# EAGLE design breakout (EAGLE 8.6.0)
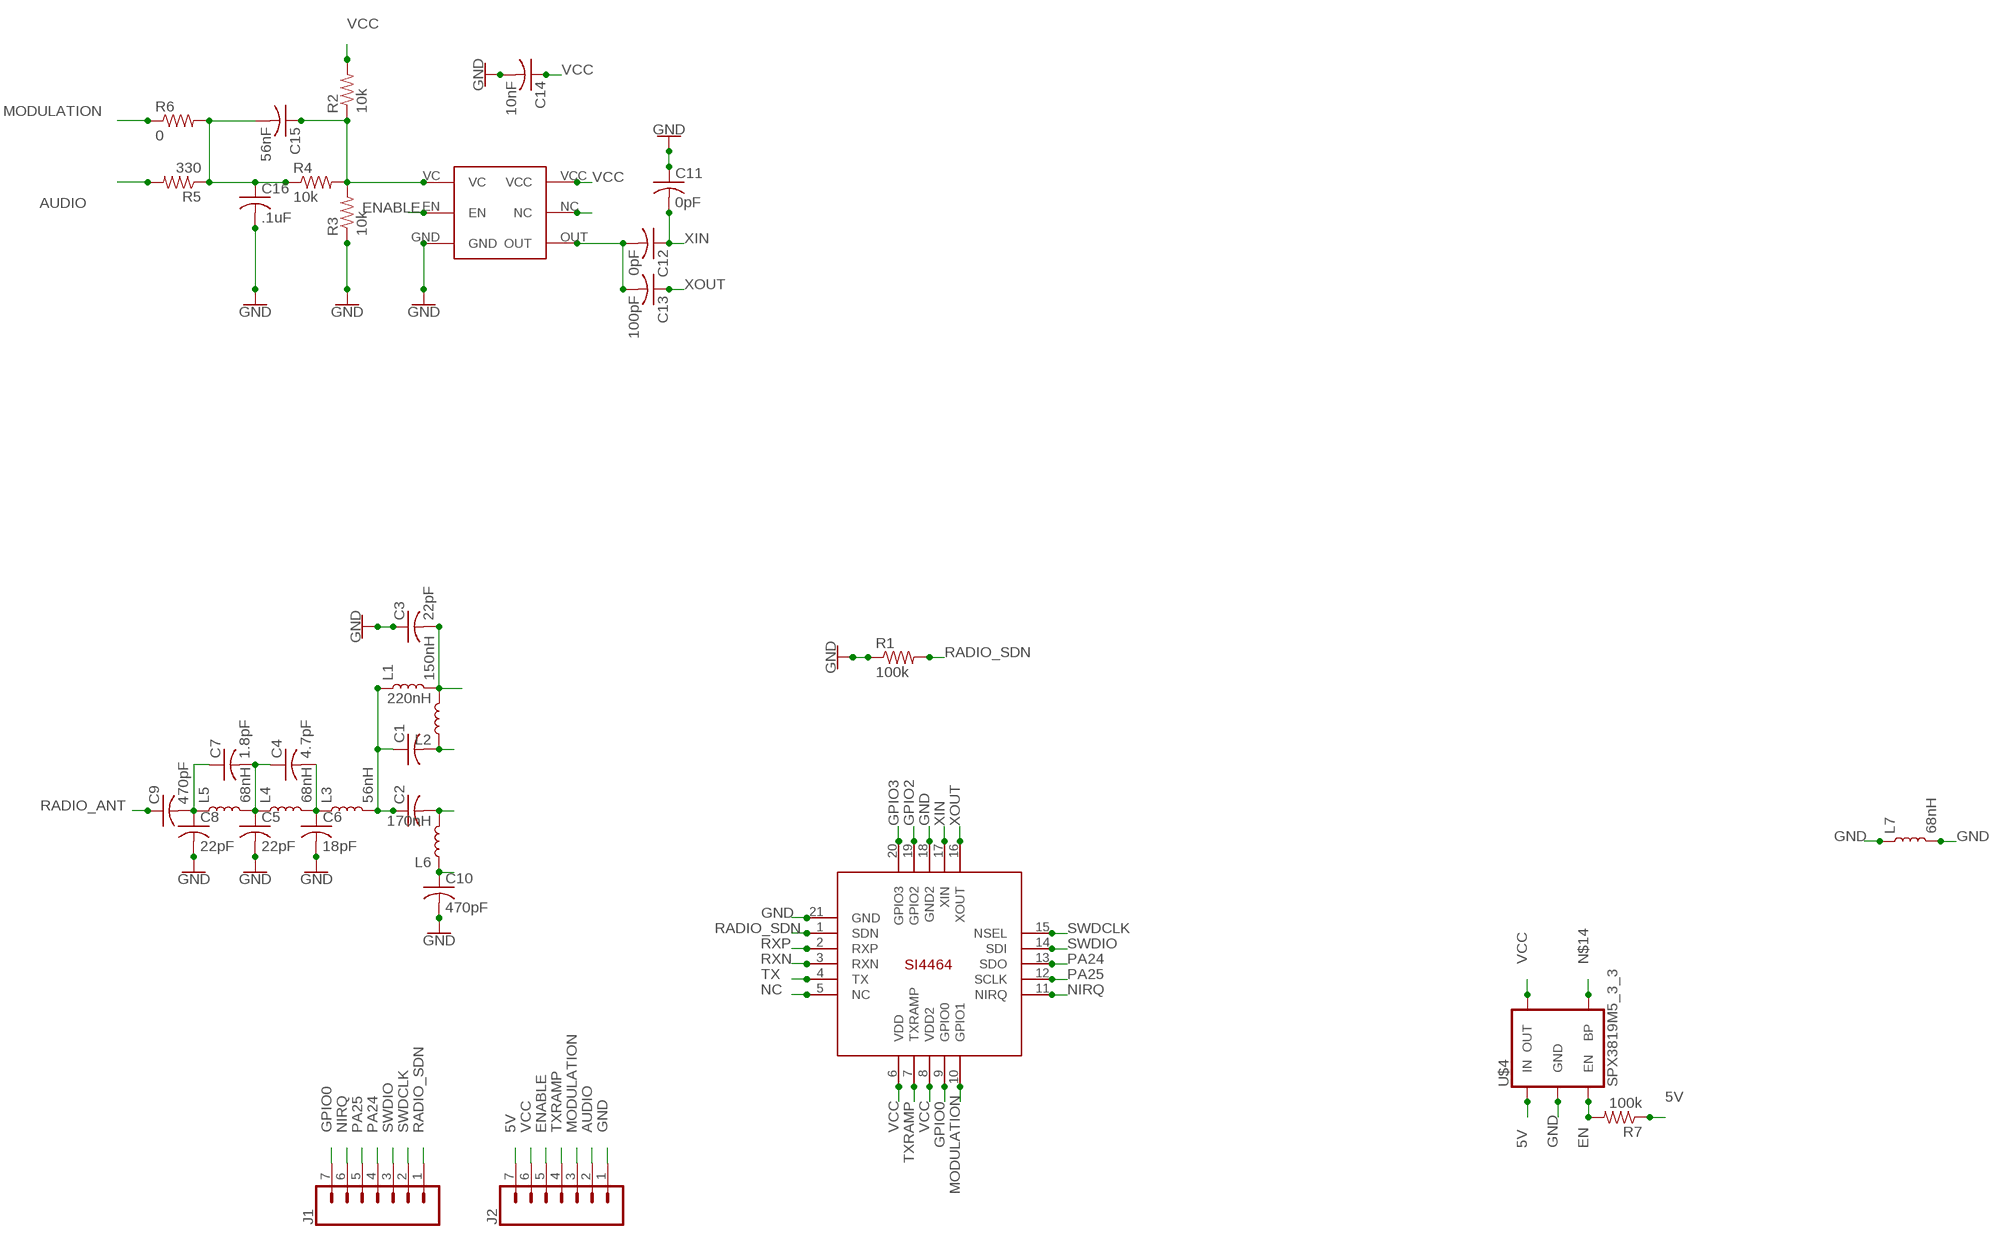
[diagram p0: schematic, sheet 1]

## Parts
C1  C-USC0402K  [C0402K]
C2  C-USC0402K  [C0402K]
C3  22pF  C-USC0402K  [C0402K]
C4  4.7pF  C-USC0402K  [C0402K]
C5  22pF  C-USC0402K  [C0402K]
C6  18pF  C-USC0402K  [C0402K]
C7  1.8pF  C-USC0402K  [C0402K]
C8  22pF  C-USC0402K  [C0402K]
C9  470pF  C-USC0402K  [C0402K]
C10  470pF  C-USC0402K  [C0402K]
C11  0pF  C-USC0402K  [C0402K]
C12  0pF  C-USC0402K  [C0402K]
C13  100pF  C-USC0402K  [C0402K]
C14  10nF  C-USC0402K  [C0402K]
C15  56nF  C-USC0402K  [C0402K]
C16  .1uF  C-USC0402K  [C0402K]
J1  CONN_07  [1X07]
J2  CONN_07  [1X07]
L1  150nH  INDUCTOR-0603-33NH  [0603]
L2  220nH  INDUCTOR-0603-33NH  [0603]
L3  56nH  INDUCTOR-0603-33NH  [0603]
L4  68nH  INDUCTOR-0603-33NH  [0603]
L5  68nH  INDUCTOR-0603-33NH  [0603]
L6  170nH  INDUCTOR-0603-33NH  [0603]
L7  68nH  INDUCTOR-0603-33NH  [0603]
R1  100k  R-US_R0402  [R0402]
R2  10k  R-US_R0402  [R0402]
R3  10k  R-US_R0402  [R0402]
R4  10k  R-US_R0402  [R0402]
R5  330  R-US_R0402  [R0402]
R6  0  R-US_R0402  [R0402]
R7  100k  R-US_R0402  [R0402]
U$1  HC53BR-27  [OSCILLATOR-SMD-7.5X5.2-6PIN]
U$2  SI4464  [QFN20+GNDPAD]
U$4  SPX3819M5_3_3  V_REG_SPX3819-SOT23-5  [SOT23-5]

## Nets
5V: J2.7 R7.1 U$4.1(IN)
AUDIO: J2.2 R5.2
EN: R7.2 U$4.3(EN)
ENABLE: J2.5 U$1.EN
GND: C3.1 C5.2 C6.2 C8.2 C10.2 C11.1 C14.2 C16.2 J2.1 L7.1 L7.2 R1.1 R3.1 U$1.GND U$2.18(GND2) U$2.21(GND) U$4.2(GND)
GPIO0: J1.7 U$2.9(GPIO0)
GPIO2: U$2.19(GPIO2)
GPIO3: U$2.20(GPIO3)
MODULATION: J2.3 R6.1 U$2.10(GPIO1)
N$1: C4.2 C6.1 L3.1 L4.2
N$2: C1.1 C2.1 L1.1 L3.2
N$3: C4.1 C5.1 C7.2 L4.1 L5.2
N$4: C15.2 C16.1 R4.1 R5.1 R6.2
N$5: C7.1 C8.1 C9.2 L5.1
N$6: C15.1 R2.1 R3.2 R4.2 U$1.VC
N$9: U$1.NC
N$14: U$4.4(BP)
NC: U$2.5(NC )
NIRQ: J1.6 U$2.11(NIRQ)
OUT: C12.2 C13.2 U$1.OUT
PA24: J1.4 U$2.13(SDO)
PA25: J1.5 U$2.12(SCLK)
RADIO_ANT: C9.1
RADIO_SDN: J1.1 R1.2 U$2.1(SDN)
RXN: C1.2 L2.1 U$2.3(RXN)
RXP: C3.2 L1.2 L2.2 U$2.2(RXP)
SWDCLK: J1.2 U$2.15(NSEL)
SWDIO: J1.3 U$2.14(SDI)
TX: C2.2 L6.2 U$2.4(TX)
TXRAMP: J2.4 U$2.7(TXRAMP)
VCC: C10.1 C14.1 J2.6 L6.1 R2.2 U$1.VCC U$2.6(VDD) U$2.8(VDD2) U$4.5(OUT)
XIN: C11.2 C12.1 U$2.17(XIN)
XOUT: C13.1 U$2.16(XOUT)

## Library data of the parts
C1-C16 = rcl:C-US: CAPACITOR, American symbol; SPICEPREFIX: C
J1 J2 = SparkFun-Connectors:CONN_07: Multi connection point. Often used as Generic Header-pin footprint for 0.1 inch spaced/style header connections On any of the 0.1 inch spaced packages, you can populate with these: Break Away Headers - Straight <https://www.sparkfun.com/products/116> (PRT-00116) Break Away Male Headers - Right Angle <https://www.sparkfun.com/products/553> (PRT-00553) Female Headers <https://www.sparkfun.com/products/115> (PRT-00115) Break Away Headers - Machine Pin <https://www.sparkfun.com/products/117> (PRT-00117) Break Away Female Headers - Swiss Machine Pin <https://www.sparkfun.com/products/743> (PRT-00743) For SCREWTERMINALS and SPRING TERMINALS visit here: Screw Terimnals on SparkFun.com <https://www.sparkfun.com/search/results?term=Screw+Terminals> (5mm/3.5mm/2.54mm spacing) This device is also useful as a general connection point to wire up your design to another part of your project. Our various solder wires solder well into these plated through hole pads. Hook-Up Wire - Assortment (Stranded, 22 AWG) <https://www.sparkfun.com/products/11375> (PRT-11375) Hook-Up Wire - Assortment (Solid Core, 22 AWG) <https://www.sparkfun.com/products/11367> (PRT-11367) View the entire wire category on our website here <https://www.sparkfun.com/categories/141> Special notes: Molex polarized connector foot print use with SKU : PRT-08231 with associated crimp pins and housings. 1MM SMD Version SKU: PRT-10208 NOTES ON THE VARIANTS LOCK and LOCK_LONGPADS... This footprint was designed to help hold the alignment of a through-hole component (i.e. 6-pin header) while soldering it into place. You may notice that each hole has been shifted either up or down by 0.005 of an inch from it's more standard position (which is a perfectly straight line). This slight alteration caused the pins (the squares in the middle) to touch the edges of the holes. Because they are alternating, it causes a "brace" to hold the component in place. 0.005 has proven to be the perfect amount of "off-center" position when using our standard breakaway headers. Although looks a little odd when you look at the bare footprint, once you have a header in there, the alteration is very hard to notice. Also,if you push a header all the way into place, it is covered up entirely on the bottom side.
L1-L7 = SparkFun-Coils:INDUCTOR: Inductors Resist changes in electrical current. Basically a coil of wire. SparkFun Products: SparkFun Load Cell Amplifier - HX711 <https://www.sparkfun.com/products/13879> IOIO-OTG - V2.2 <https://www.sparkfun.com/products/13613>; PROD_ID: NDUC-07874; VALUE: 33nH/±5%/500mA
R1-R7 = resistor:R-US_: RESISTOR, American symbol
U$1 = SparkFun-Clocks-custom:HC53BR-27: HC53BR-27
U$2 = Ava:SI4464
U$4 = SparkFun-IC-Power:V_REG_SPX3819: SPX3819 Voltage Regulator 3.3V 500mA, 16V input Datasheet <https://www.exar.com/content/document.ashx?id=22106> SparkFun Products: SparkFun Serial Controlled Motor Driver <https://www.sparkfun.com/products/13911>; PROD_ID: VREG-13321

## Board
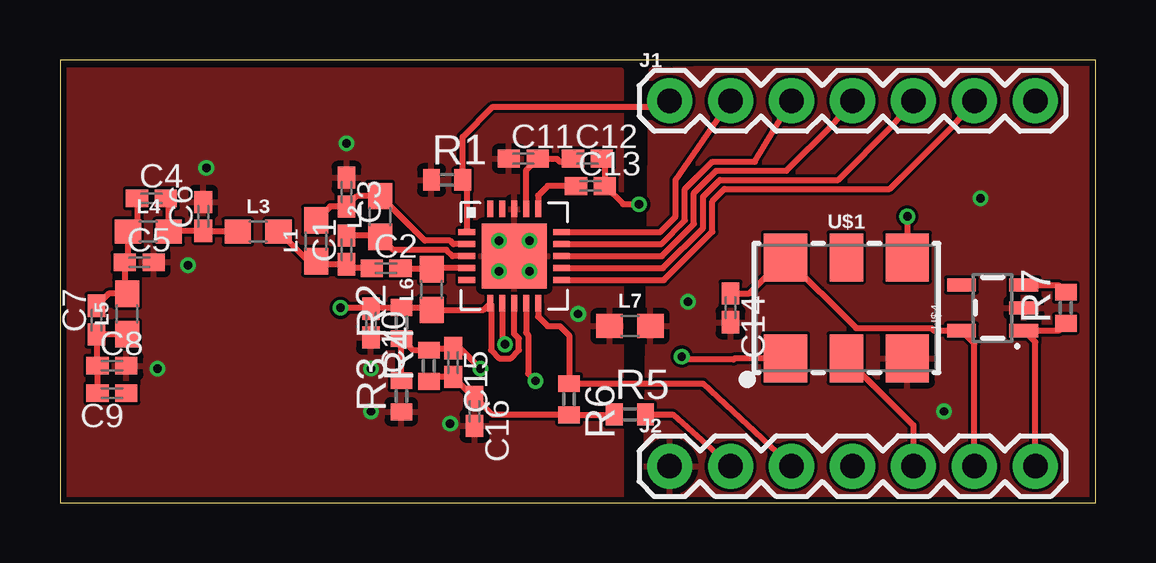
[diagram p1: board, top side]
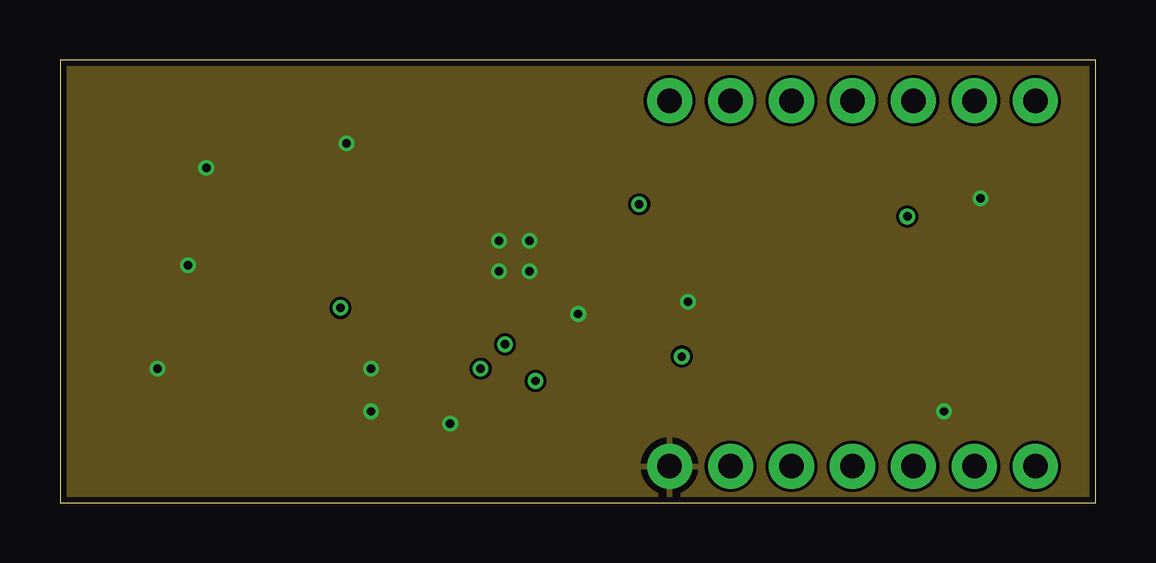
[diagram p2: board, inner layer Route2]
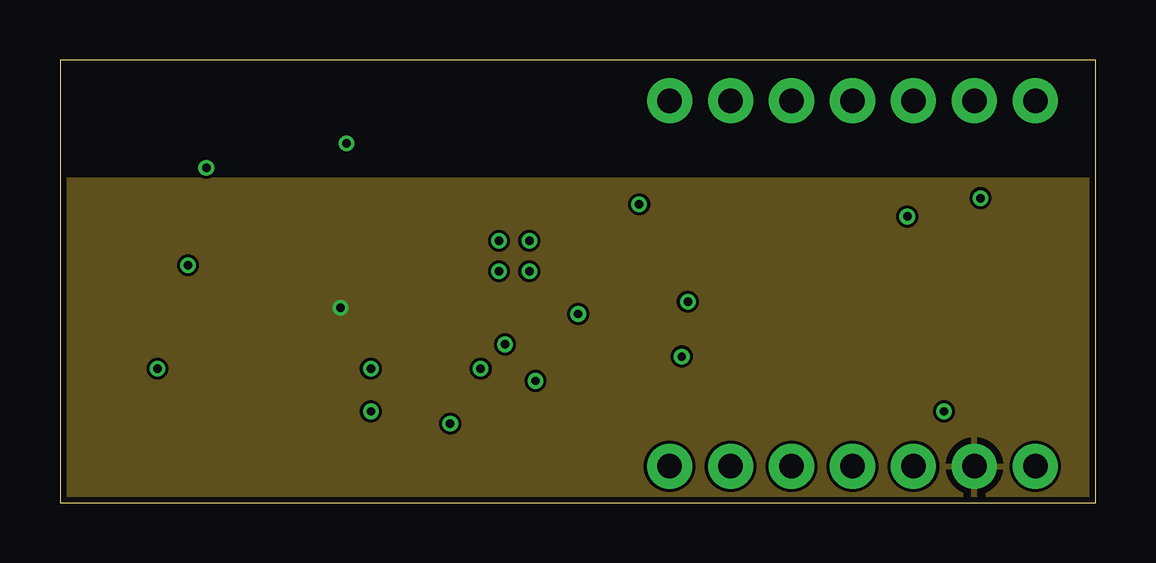
[diagram p3: board, inner layer Route14]
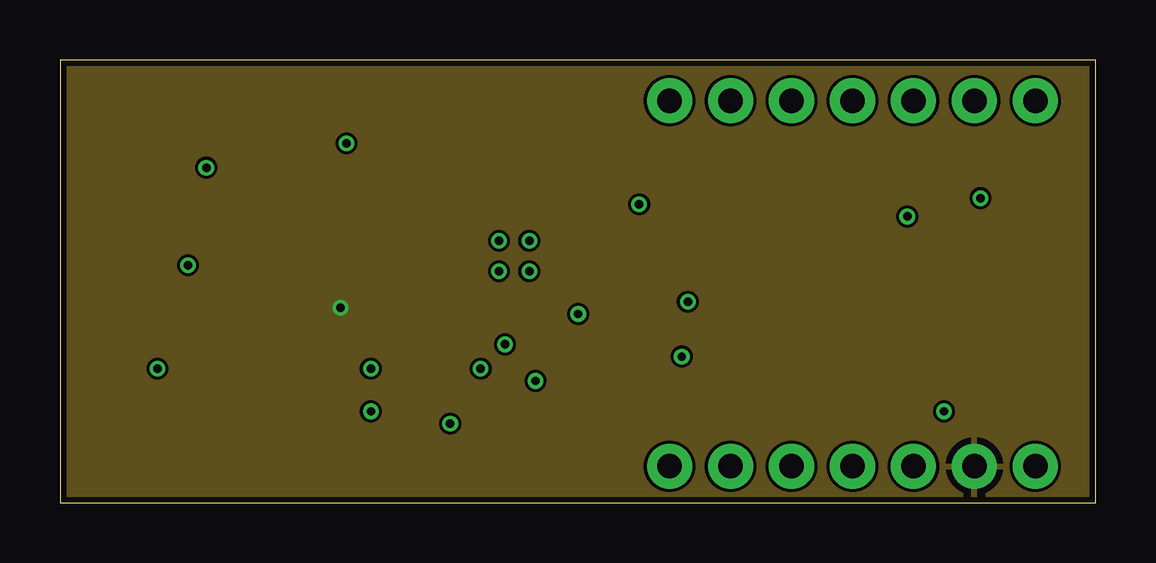
[diagram p4: board, inner layer Route15]
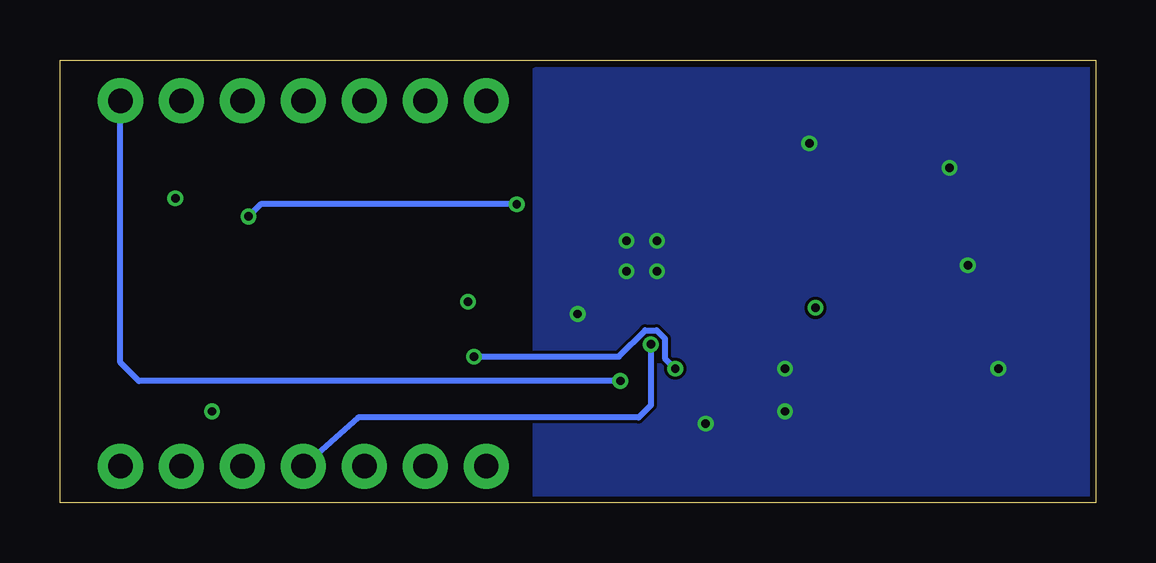
[diagram p5: board, bottom side, seen from below]

Size 43.16 x 18.47 mm. Coordinates in mm from the lower left corner, seen from the top.
Outline: 0,0 43.16,0 43.16,18.47 0,18.47 0,0
Copper layers (1*2*3*14*15*16): Top 0.035mm / dielectric 0.23mm / Route2 0.035mm / dielectric 0.38mm / Route3 0.035mm / dielectric 0.15mm / Route14 0.035mm / dielectric 0.38mm / Route15 0.035mm / dielectric 0.23mm / Bottom 0.035mm
Design rules "MF_Standard_6_Layer": minimum track width 5mil, minimum drill 12mil, track to track 5mil, track to pad 5mil, pad to pad 5mil, via to via 5mil, smd to smd 0mil, copper to edge 10mil, drill to drill 10mil, minimum pad ring 6mil, minimum via ring 6mil, stop-mask expansion 2mil, vias tented up to drill 25mil, thermal gap 10mil

### Footprints (pad centres in the part's own frame; a part is rotated, then mirrored left to right if it is on the bottom)
C0402K = smd 0.925 x 0.74: 1 -0.6,0; 2 0.6,0
1X07 = drill 1.016 pad 1.88: 1 0,0; 2 2.54,0; 3 5.08,0; 4 7.62,0; 5 10.16,0; 6 12.7,0; 7 15.24,0
0603 = smd 1.1 x 1: 1 -0.85,0; 2 0.85,0
R0402 = smd 0.7 x 0.9: 1 -0.65,0; 2 0.65,0
OSCILLATOR-SMD-7.5X5.2-6PIN = smd 1.4 x 2: EN 0,-2.1; NC 0,2.1 | smd 1.8 x 2: GND 2.54,-2.1; OUT 2.54,2.1; VC -2.54,-2.1; VCC -2.54,2.1
QFN20+GNDPAD = smd 0.7 x 0.25: 1 -1.97,1; 2 -1.97,0.5; 3 -1.97,0; 4 -1.97,-0.5; 5 -1.97,-1; 11 1.97,-1; 12 1.97,-0.5; 13 1.97,0; 14 1.97,0.5; 15 1.97,1 | smd 0.25 x 0.7: 6 -1,-1.97; 7 -0.5,-1.97; 8 0,-1.97; 9 0.5,-1.97; 10 1,-1.97; 16 1,1.97; 17 0.5,1.97; 18 0,1.97; 19 -0.5,1.97; 20 -1,1.97 | smd 2.7 x 2.7: 21 0,0
SOT23-5 = smd 0.55 x 1.2: 1 -0.95,-1.3; 2 0,-1.3; 3 0.95,-1.3; 4 0.95,1.3; 5 -0.95,1.3

### Placement (x,y rotation side)
C1  11.94,10.54 90 top
C2  13.59,9.78 0 top
C3  11.94,12.95 270 top
C4  3.81,12.7 0 top
C5  3.3,10.03 0 top
C6  5.97,11.94 90 top
C7  1.52,7.62 90 top
C8  2.16,5.71 0 top
C9  2.16,4.57 180 top
C10  12.95,7.49 270 top
C11  19.3,14.35 0 top
C12  21.97,14.35 0 top
C13  22.1,13.21 0 top
C14  27.94,8.13 270 top
C15  16.38,5.84 270 top
C16  17.27,3.81 270 top
J1  25.4,16.76 0 top
J2  25.4,1.52 0 top
L1  10.67,10.92 90 top
L2  13.34,11.94 90 top
L3  8.26,11.3 0 top
L4  3.68,11.3 0 top
L5  2.79,7.87 90 top
L6  15.49,8.89 90 top
L7  23.75,7.37 0 top
R1  16.13,13.46 0 top
R2  14.22,7.49 90 top
R3  14.22,4.45 90 top
R4  15.37,5.71 90 top
R5  23.75,3.68 0 top
R6  21.21,4.32 270 top
R7  41.91,8.13 90 top
U$1  32.77,8.13 0 top
U$2  18.92,10.29 0 top
U$4  38.86,8.13 90 top

### Tracks (layer width: path | path; a pad name or v marks a point on that pad's centre or on a via)
5V
  Top 0.254: J2.7 40.64,6.7 U$4.1 41.61,7.18 R7.1
AUDIO
  Top 0.254: R5.2 25.53,3.68 J2.2
EN
  Top 0.254: U$4.3 41.61,9.08 R7.2
ENABLE
  Top 0.254: U$1.EN 35.56,3.23 J2.5
GND  (via drill 0.35)
  Top 0.254: U$2.21 v19.56,9.65
  other vias: 18.29,10.92 19.56,10.92 18.29,9.65 16.26,3.3 12.95,3.81 12.95,5.59 11.94,14.99 6.1,13.97 5.33,9.91 4.06,5.59 21.59,7.87 36.83,3.81 38.35,12.7 26.16,8.38
  pour Top: 0,18.03 23.37,18.03 23.37,-1.02 0,-1.02
  pour Top: 24.64,18.03 24.38,-1.02 45.72,-0.51 45.97,18.54
  pour Route2: -0.51,18.29 45.97,18.54 45.97,0.25 0,0
  pour Bottom: 0,18.03 23.37,18.03 23.37,-1.02 0,-1.02
GPIO0  (via drill 0.35)
  Top 0.254: U$2.9 19.42,7.08 19.5,7 19.5,5.39 v19.81,5.08
  Bottom 0.254: v19.81,5.08 39.88,5.08 40.64,5.84 J1.7
MODULATION
  Top 0.254: U$2.10 19.92,7.76 20.32,7.37 20.83,7.37 21.21,6.98 R6.1 26.78,4.97 J2.3
N$1
  Top 0.254: L3.1 6,11.3 C6.1 4.57,11.34 L4.2 4.53,12.58 C4.2
N$2
  Top 0.254: C2.1 12.1,9.78 C1.1 10.8,9.94 L1.1 10.34,10.07 L3.2
N$3
  Top 0.254: C4.1 3.21,11.68 L4.1 2.83,10.16 C5.1 2.7,8.82 L5.2 2.03,8.72 C7.2
N$4
  Top 0.254: R4.1 15.54,5.24 C15.2 17.21,4.41 C16.1 18.01,3.67 R6.2 23.08,3.67 R5.1
N$5
  Top 0.254: L5.1 C7.1 1.52,5.75 C8.1 C9.2
N$6  (via drill 0.35)
  Top 0.254: R3.2 R2.1 14.7,6.37 R4.2 15.44,6.44 C15.1 16.67,6.44 v17.53,5.59 | U$1.VC 28.13,6.03 28.07,5.97 26.04,5.97 v25.91,6.1
  Bottom 0.254: v25.91,6.1 19.87,6.1 18.78,7.19 18.3,7.19 17.96,6.84 17.96,6.02 v17.53,5.59
NIRQ
  Top 0.254: U$2.11 25.16,9.29 27.18,11.31 27.18,12.57 27.69,13.08 34.58,13.08 37.25,15.75 J1.6
OUT  (via drill 0.35)
  Top 0.254: C12.2 22.7,14.22 C13.2 23.46,12.45 v24.13,12.45 | v35.31,11.94 U$1.OUT
  Bottom 0.254: v24.13,12.45 34.8,12.45 v35.31,11.94
PA24
  Top 0.254: U$2.13 25.08,10.29 26.42,11.62 26.42,12.92 27.34,13.84 30.26,13.84 32.17,15.75 J1.4
PA25
  Top 0.254: U$2.12 25.12,9.79 26.8,11.46 26.8,12.77 27.49,13.46 32.42,13.46 34.71,15.75 J1.5
RADIO_SDN
  Top 0.254: J1.1 24.64,16.51 18.03,16.51 16.78,15.26 R1.2 16.95,13.29 U$2.1
RXN
  Top 0.254: U$2.3 16.36,10.29 16.1,10.54 13.88,10.54 L2.1 13.28,11.14 C1.2
RXP
  Top 0.254: U$2.2 16.39,10.79 16.26,10.93 15.2,10.93 L2.2 12.37,12.79 C3.2 11.25,12.35 L1.2
SWDCLK
  Top 0.254: U$2.15 25,11.29 25.65,11.94 25.65,13.46 J1.2
SWDIO
  Top 0.254: U$2.14 25.04,10.79 26.04,11.78 26.04,13.08 27.18,14.22 28.96,14.22 J1.3
TX
  Top 0.254: U$2.4 15.54,9.79 L6.2 14.23,9.74 C2.2
TXRAMP  (via drill 0.35)
  Top 0.254: U$2.7 18.42,6.72 v18.54,6.6
  Bottom 0.254: v18.54,6.6 18.54,4.06 19.05,3.56 30.73,3.56 J2.4
VCC  (via drill 0.35)
  Top 0.254: U$2.8 18.92,7.04 19.12,6.84 19.12,6.36 18.78,6.02 18.3,6.02 17.96,6.36 17.96,8.28 U$2.6 17.65,8.04 L6.1 15.39,8.14 R2.2 13,8.14 C10.1 12.92,8.13 v11.68,8.13 | C14.1 28.73,8.73 U$1.VCC 33.17,7.28 36.31,7.28 36.41,7.18 U$4.5 38.1,6.64 J2.6
  pour Route14: 0,13.46 43.18,13.46 43.18,0 0,0
  pour Route15: 0.25,18.29 43.18,18.29 43.18,0 0.25,0
XIN
  Top 0.254: U$2.17 19.42,13.87 C11.2 20.7,14.35 20.83,14.22 21.24,14.22 C12.1
XOUT
  Top 0.254: C13.1 20.32,13.21 19.92,12.81 U$2.16